# EAGLE schematic haasoscope_pro_adc_board - no blind (EAGLE 9.6.2)

## Sheet 1 of 3
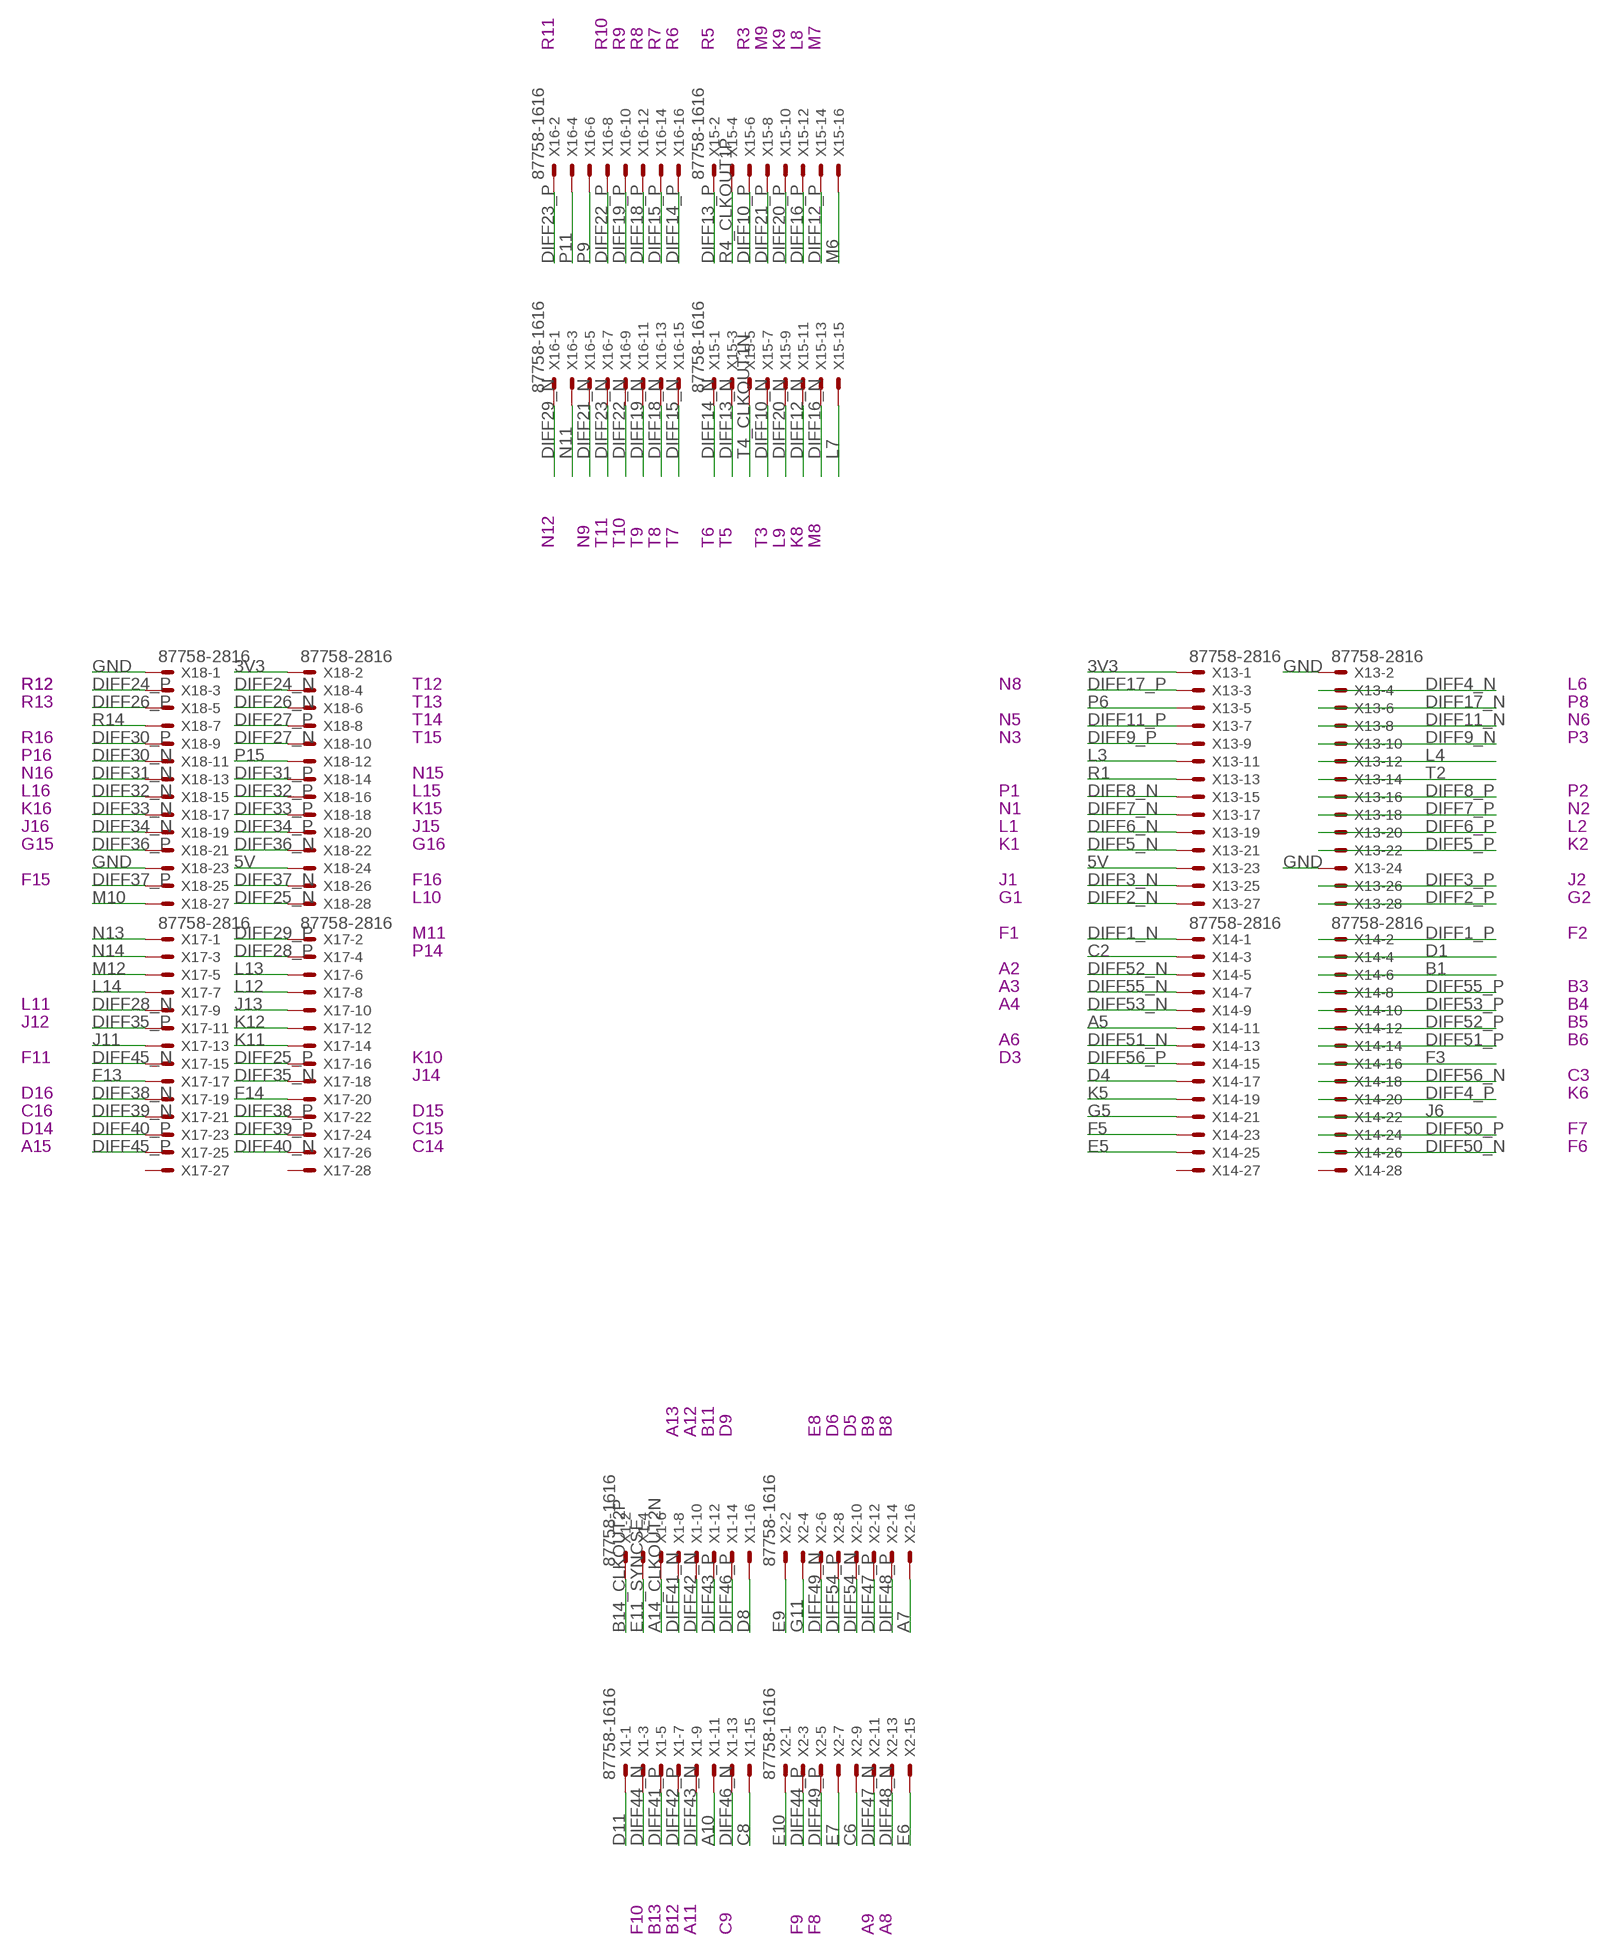
[diagram p0: schematic, sheet 1]

### Parts
X1  87758-1616  [87758-1616]
X2  87758-1616  [87758-1616]
X13  87758-2816  [87758-2816]
X14  87758-2816  [87758-2816]
X15  87758-1616  [87758-1616]
X16  87758-1616  [87758-1616]
X17  87758-2816  [87758-2816]
X18  87758-2816  [87758-2816]

### Nets
3V3 [power]: X13.1 X18.2 ; also sheet 2
5V [power]: X13.23 X18.24 ; also sheet 2
A5: X14.11 ; also sheet 2
A7: X2.16 ; also sheet 2
A10: X1.11 ; also sheet 2
A14_CLKOUT2N [loosediffpair]: X1.6 ; also sheet 2
B1: X14.6 ; also sheet 2
B14_CLKOUT2P [loosediffpair]: X1.2 ; also sheet 2
C2: X14.3 ; also sheet 2
C6: X2.9 ; also sheet 2
C8: X1.15 ; also sheet 2
D1: X14.4 ; also sheet 2
D4: X14.17 ; also sheet 2
D8: X1.16 ; also sheet 2
D11: X1.1 ; also sheet 2
DIFF1_N [diffpair]: X14.1 ; also sheet 2
DIFF1_P [diffpair]: X14.2 ; also sheet 2
DIFF2_N [diffpair]: X13.27 ; also sheet 2
DIFF2_P [diffpair]: X13.28 ; also sheet 2
DIFF3_N [diffpair]: X13.25 ; also sheet 2
DIFF3_P [diffpair]: X13.26 ; also sheet 2
DIFF4_N [diffpair]: X13.4 ; also sheet 2
DIFF4_P [diffpair]: X14.20 ; also sheet 2
DIFF5_N [diffpair]: X13.21 ; also sheet 2
DIFF5_P [diffpair]: X13.22 ; also sheet 2
DIFF6_N [diffpair]: X13.19 ; also sheet 2
DIFF6_P [diffpair]: X13.20 ; also sheet 2
DIFF7_N [diffpair]: X13.17 ; also sheet 2
DIFF7_P [diffpair]: X13.18 ; also sheet 2
DIFF8_N [diffpair]: X13.15 ; also sheet 2
DIFF8_P [diffpair]: X13.16 ; also sheet 2
DIFF9_N [diffpair]: X13.10 ; also sheet 2
DIFF9_P [diffpair]: X13.9 ; also sheet 2
DIFF10_N [diffpair]: X15.7 ; also sheet 2
DIFF10_P [diffpair]: X15.6 ; also sheet 2
DIFF11_N [diffpair]: X13.8 ; also sheet 2
DIFF11_P [diffpair]: X13.7 ; also sheet 2
DIFF12_N [diffpair]: X15.11 ; also sheet 2
DIFF12_P [diffpair]: X15.14 ; also sheet 2
DIFF13_N [diffpair]: X15.3 ; also sheet 2
DIFF13_P [diffpair]: X15.2 ; also sheet 2
DIFF14_N [diffpair]: X15.1 ; also sheet 2
DIFF14_P [diffpair]: X16.16 ; also sheet 2
DIFF15_N [diffpair]: X16.15 ; also sheet 2
DIFF15_P [diffpair]: X16.14 ; also sheet 2
DIFF16_N [diffpair]: X15.13 ; also sheet 2
DIFF16_P [diffpair]: X15.12 ; also sheet 2
DIFF17_N [diffpair]: X13.6 ; also sheet 2
DIFF17_P [diffpair]: X13.3 ; also sheet 2
DIFF18_N [diffpair]: X16.13 ; also sheet 2
DIFF18_P [diffpair]: X16.12 ; also sheet 2
DIFF19_N [diffpair]: X16.11 ; also sheet 2
DIFF19_P [diffpair]: X16.10 ; also sheet 2
DIFF20_N [diffpair]: X15.9 ; also sheet 2
DIFF20_P [diffpair]: X15.10 ; also sheet 2
DIFF21_N [diffpair]: X16.5 ; also sheet 2
DIFF21_P [diffpair]: X15.8 ; also sheet 2
DIFF22_N [diffpair]: X16.9 ; also sheet 2
DIFF22_P [diffpair]: X16.8 ; also sheet 2
DIFF23_N [diffpair]: X16.7 ; also sheet 2
DIFF23_P [diffpair]: X16.2 ; also sheet 2
DIFF24_N [diffpair]: X18.4 ; also sheet 2
DIFF24_P [diffpair]: X18.3 ; also sheet 2
DIFF25_N [diffpair]: X18.28 ; also sheet 2
DIFF25_P [diffpair]: X17.16 ; also sheet 2
DIFF26_N [diffpair]: X18.6 ; also sheet 2
DIFF26_P [diffpair]: X18.5 ; also sheet 2
DIFF27_N [diffpair]: X18.10 ; also sheet 2
DIFF27_P [diffpair]: X18.8 ; also sheet 2
DIFF28_N [diffpair]: X17.9 ; also sheet 2
DIFF28_P [diffpair]: X17.4 ; also sheet 2
DIFF29_N [diffpair]: X16.1 ; also sheet 2
DIFF29_P [diffpair]: X17.2 ; also sheet 2
DIFF30_N [diffpair]: X18.11 ; also sheet 2
DIFF30_P [diffpair]: X18.9 ; also sheet 2
DIFF31_N [diffpair]: X18.13 ; also sheet 2
DIFF31_P [diffpair]: X18.14 ; also sheet 2
DIFF32_N [diffpair]: X18.15 ; also sheet 2
DIFF32_P [diffpair]: X18.16 ; also sheet 2
DIFF33_N [diffpair]: X18.17 ; also sheet 2
DIFF33_P [diffpair]: X18.18 ; also sheet 2
DIFF34_N [diffpair]: X18.19 ; also sheet 2
DIFF34_P [diffpair]: X18.20 ; also sheet 2
DIFF35_N [diffpair]: X17.18 ; also sheet 2
DIFF35_P [diffpair]: X17.11 ; also sheet 2
DIFF36_N [diffpair]: X18.22 ; also sheet 2
DIFF36_P [diffpair]: X18.21 ; also sheet 2
DIFF37_N [diffpair]: X18.26 ; also sheet 2
DIFF37_P [diffpair]: X18.25 ; also sheet 2
DIFF38_N [diffpair]: X17.19 ; also sheet 2
DIFF38_P [diffpair]: X17.22 ; also sheet 2
DIFF39_N [diffpair]: X17.21 ; also sheet 2
DIFF39_P [diffpair]: X17.24 ; also sheet 2
DIFF40_N [diffpair]: X17.26 ; also sheet 2
DIFF40_P [diffpair]: X17.23 ; also sheet 2
DIFF41_N [diffpair]: X1.8 ; also sheet 2
DIFF41_P [diffpair]: X1.5 ; also sheet 2
DIFF42_N [diffpair]: X1.10 ; also sheet 2
DIFF42_P [diffpair]: X1.7 ; also sheet 2
DIFF43_N [diffpair]: X1.9 ; also sheet 2
DIFF43_P [diffpair]: X1.12 ; also sheet 2
DIFF44_N [diffpair]: X1.3 ; also sheet 2
DIFF44_P [diffpair]: X2.3 ; also sheet 2
DIFF45_N [diffpair]: X17.15 ; also sheet 2
DIFF45_P [diffpair]: X17.25 ; also sheet 2
DIFF46_N [diffpair]: X1.13 ; also sheet 2
DIFF46_P [diffpair]: X1.14 ; also sheet 2
DIFF47_N [diffpair]: X2.11 ; also sheet 2
DIFF47_P [diffpair]: X2.12 ; also sheet 2
DIFF48_N [diffpair]: X2.13 ; also sheet 2
DIFF48_P [diffpair]: X2.14 ; also sheet 2
DIFF49_N [diffpair]: X2.6 ; also sheet 2
DIFF49_P [diffpair]: X2.5 ; also sheet 2
DIFF50_N [diffpair]: X14.26 ; also sheet 2
DIFF50_P [diffpair]: X14.24 ; also sheet 2
DIFF51_N [diffpair]: X14.13 ; also sheet 2
DIFF51_P [diffpair]: X14.14 ; also sheet 2
DIFF52_N [diffpair]: X14.5 ; also sheet 2
DIFF52_P [diffpair]: X14.12 ; also sheet 2
DIFF53_N [diffpair]: X14.9 ; also sheet 2
DIFF53_P [diffpair]: X14.10 ; also sheet 2
DIFF54_N [diffpair]: X2.10 ; also sheet 2
DIFF54_P [diffpair]: X2.8 ; also sheet 2
DIFF55_N [diffpair]: X14.7 ; also sheet 2
DIFF55_P [diffpair]: X14.8 ; also sheet 2
DIFF56_N [diffpair]: X14.18 ; also sheet 2
DIFF56_P [diffpair]: X14.15 ; also sheet 2
E5: X14.25 ; also sheet 2
E6: X2.15 ; also sheet 2
E7: X2.7 ; also sheet 2
E9: X2.2 ; also sheet 2
E10: X2.1 ; also sheet 2
E11_SYNCSE: X1.4 ; also sheet 2
F3: X14.16 ; also sheet 2
F5: X14.23 ; also sheet 2
F13: X17.17 ; also sheet 2
F14: X17.20 ; also sheet 2
G5: X14.21 ; also sheet 2
G11: X2.4 ; also sheet 2
GND [power]: X13.2 X13.24 X18.1 X18.23 ; also sheet 2,3
J6: X14.22 ; also sheet 2
J11: X17.13 ; also sheet 2
J13: X17.10 ; also sheet 2
K5: X14.19 ; also sheet 2
K11: X17.14 ; also sheet 2
K12: X17.12 ; also sheet 2
L3: X13.11 ; also sheet 2
L4: X13.12 ; also sheet 2
L7: X15.15 ; also sheet 2
L12: X17.8 ; also sheet 2
L13: X17.6 ; also sheet 2
L14: X17.7 ; also sheet 2
M6: X15.16 ; also sheet 2
M10: X18.27 ; also sheet 2
M12: X17.5 ; also sheet 2
N11: X16.3 ; also sheet 2
N13: X17.1 ; also sheet 2
N14: X17.3 ; also sheet 2
P6: X13.5 ; also sheet 2
P9: X16.6 ; also sheet 2
P11: X16.4 ; also sheet 2
P15: X18.12 ; also sheet 2
R1: X13.13 ; also sheet 2
R4_CLKOUT1P [loosediffpair]: X15.4 ; also sheet 2
R14: X18.7 ; also sheet 2
T2: X13.14 ; also sheet 2
T4_CLKOUT1N [loosediffpair]: X15.5 ; also sheet 2
Unconnected: X14.27 X14.28 X17.27 X17.28

### Notes on the sheet
- R11 | R10 | R9 | R8 | R7 | R6 | R5 | R3 | M9 | K9 | L8 | M7
- N12 | N9 | T11 | T10 | T9 | T8 | T7 | T6 | T5 | T3 | L9 | K8 | M8
- R12 | R12 | T12 | N8 | L6
- R13 | T13 | P8
- T14 | N5 | N6
- R16 | T15 | N3 | P3
- P16
- N16 | N15
- L16 | L15 | P1 | P2
- K16 | K15 | N1 | N2
- J16 | J15 | L1 | L2
- G15 | G16 | K1 | K2
- F15 | F16 | J1 | J2
- L10 | G1 | G2
- M11 | F1 | F2
- P14
- A2
- A3 | B3
- L11 | A4 | B4
- J12 | B5
- A6 | B6
- F11 | K10 | D3
- J14 | C3
- D16 | K6
- C16 | D15
- D14 | C15 | F7
- A15 | C14 | F6
- A13 | A12 | B11 | D9 | E8 | D6 | D5 | B9 | B8
- F10 | B13 | B12 | A11 | C9 | F9 | F8 | A9 | A8

## Sheet 2 of 3
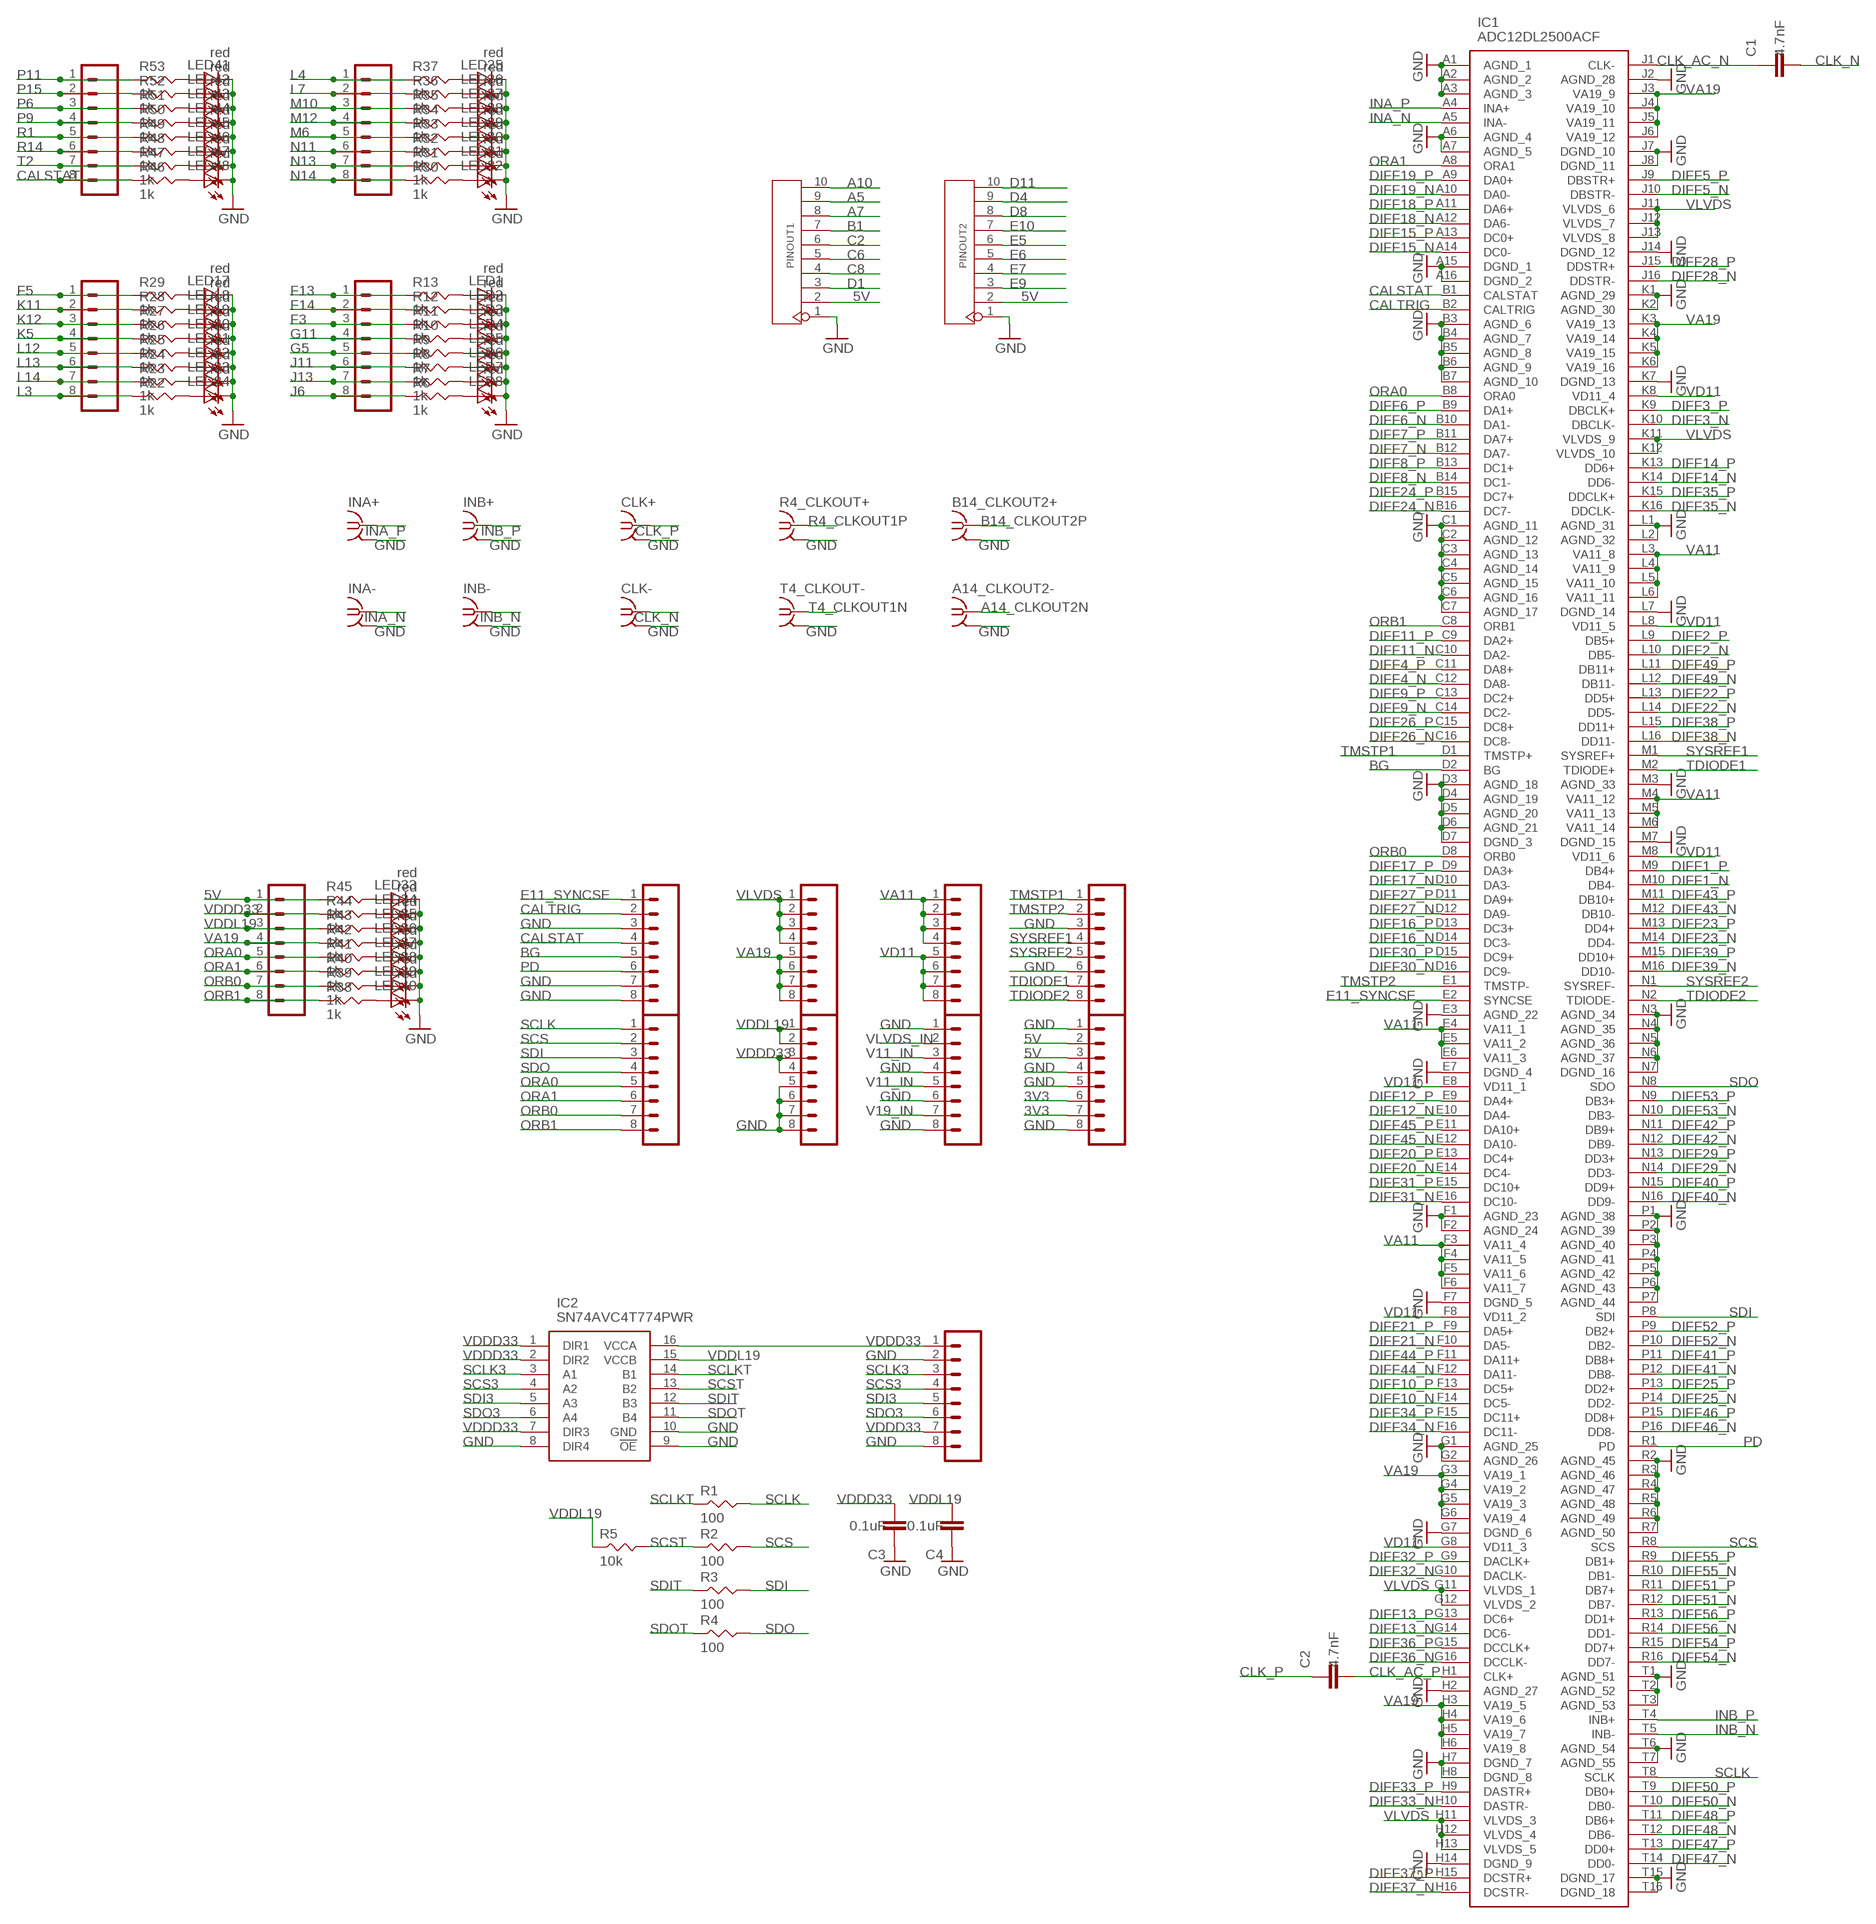
[diagram p1: schematic, sheet 2]

### Parts
A14_CLKOUT2-  BU-SMB-V  [BU-SMB-V]
B14_CLKOUT2+  BU-SMB-V  [BU-SMB-V]
C1  4.7nF  CAPACITOR_0402_N  [RESC0402_N]
C2  4.7nF  CAPACITOR_0402_N  [RESC0402_N]
C3  0.1uF  CAPACITOR_0402_N  [RESC0402_N]
C4  0.1uF  CAPACITOR_0402_N  [RESC0402_N]
CLK+  BU-SMB-V  [BU-SMB-V]
CLK-  BU-SMB-V  [BU-SMB-V]
IC1  ADC12DL2500ACF  [BGA256C100P16X16_1700X1700X331]
IC2  SN74AVC4T774PWR  [SOP65P640X120-16N]
INA+  BU-SMB-V  [BU-SMB-V]
INA-  BU-SMB-V  [BU-SMB-V]
INB+  BU-SMB-V  [BU-SMB-V]
INB-  BU-SMB-V  [BU-SMB-V]
J1  8pin  CONN_08"  [1X08]
J2  8pin  CONN_08"  [1X08]
J3  8pin  CONN_08"  [1X08]
J4  8pin  CONN_08"  [1X08]
J5  8pin  CONN_08"  [1X08]
J6  8pin  CONN_08"  [1X08]
J7  8pin  CONN_08"  [1X08]
J8  8pin  CONN_08"  [1X08]
J10  8pin  CONN_08"  [1X08]
J11  8pin  CONN_08"  [1X08]
J12  8pin  CONN_08"  [1X08]
J13  8pin  CONN_08"  [1X08]
J16  8pin  CONN_08"  [1X08]
J17  8pin  CONN_08"  [1X08]
LED1  red  LEDCHIP-LED0603  [CHIP-LED0603]
LED2  red  LEDCHIP-LED0603  [CHIP-LED0603]
LED3  red  LEDCHIP-LED0603  [CHIP-LED0603]
LED4  red  LEDCHIP-LED0603  [CHIP-LED0603]
LED5  red  LEDCHIP-LED0603  [CHIP-LED0603]
LED6  red  LEDCHIP-LED0603  [CHIP-LED0603]
LED7  red  LEDCHIP-LED0603  [CHIP-LED0603]
LED8  red  LEDCHIP-LED0603  [CHIP-LED0603]
LED17  red  LEDCHIP-LED0603  [CHIP-LED0603]
LED18  red  LEDCHIP-LED0603  [CHIP-LED0603]
LED19  red  LEDCHIP-LED0603  [CHIP-LED0603]
LED20  red  LEDCHIP-LED0603  [CHIP-LED0603]
LED21  red  LEDCHIP-LED0603  [CHIP-LED0603]
LED22  red  LEDCHIP-LED0603  [CHIP-LED0603]
LED23  red  LEDCHIP-LED0603  [CHIP-LED0603]
LED24  red  LEDCHIP-LED0603  [CHIP-LED0603]
LED25  red  LEDCHIP-LED0603  [CHIP-LED0603]
LED26  red  LEDCHIP-LED0603  [CHIP-LED0603]
LED27  red  LEDCHIP-LED0603  [CHIP-LED0603]
LED28  red  LEDCHIP-LED0603  [CHIP-LED0603]
LED29  red  LEDCHIP-LED0603  [CHIP-LED0603]
LED30  red  LEDCHIP-LED0603  [CHIP-LED0603]
LED31  red  LEDCHIP-LED0603  [CHIP-LED0603]
LED32  red  LEDCHIP-LED0603  [CHIP-LED0603]
LED33  red  LEDCHIP-LED0603  [CHIP-LED0603]
LED34  red  LEDCHIP-LED0603  [CHIP-LED0603]
LED35  red  LEDCHIP-LED0603  [CHIP-LED0603]
LED36  red  LEDCHIP-LED0603  [CHIP-LED0603]
LED37  red  LEDCHIP-LED0603  [CHIP-LED0603]
LED38  red  LEDCHIP-LED0603  [CHIP-LED0603]
LED39  red  LEDCHIP-LED0603  [CHIP-LED0603]
LED40  red  LEDCHIP-LED0603  [CHIP-LED0603]
LED41  red  LEDCHIP-LED0603  [CHIP-LED0603]
LED42  red  LEDCHIP-LED0603  [CHIP-LED0603]
LED43  red  LEDCHIP-LED0603  [CHIP-LED0603]
LED44  red  LEDCHIP-LED0603  [CHIP-LED0603]
LED45  red  LEDCHIP-LED0603  [CHIP-LED0603]
LED46  red  LEDCHIP-LED0603  [CHIP-LED0603]
LED47  red  LEDCHIP-LED0603  [CHIP-LED0603]
LED48  red  LEDCHIP-LED0603  [CHIP-LED0603]
PINOUT1  YELLOW-10P-2.54  DIP-YELLOW-FEMALE-HEADER-VERT(10P-2.54)  [H10-2.54]
PINOUT2  YELLOW-10P-2.54  DIP-YELLOW-FEMALE-HEADER-VERT(10P-2.54)  [H10-2.54]
R1  100  RES-0402  [RES-0402]
R2  100  RES-0402  [RES-0402]
R3  100  RES-0402  [RES-0402]
R4  100  RES-0402  [RES-0402]
R4_CLKOUT+  BU-SMB-V  [BU-SMB-V]
R5  10k  RES-0402  [RES-0402]
R6  1k  RES-0402  [RES-0402]
R7  1k  RES-0402  [RES-0402]
R8  1k  RES-0402  [RES-0402]
R9  1k  RES-0402  [RES-0402]
R10  1k  RES-0402  [RES-0402]
R11  1k  RES-0402  [RES-0402]
R12  1k  RES-0402  [RES-0402]
R13  1k  RES-0402  [RES-0402]
R22  1k  RES-0402  [RES-0402]
R23  1k  RES-0402  [RES-0402]
R24  1k  RES-0402  [RES-0402]
R25  1k  RES-0402  [RES-0402]
R26  1k  RES-0402  [RES-0402]
R27  1k  RES-0402  [RES-0402]
R28  1k  RES-0402  [RES-0402]
R29  1k  RES-0402  [RES-0402]
R30  1k  RES-0402  [RES-0402]
R31  1k  RES-0402  [RES-0402]
R32  1k  RES-0402  [RES-0402]
R33  1k  RES-0402  [RES-0402]
R34  1k  RES-0402  [RES-0402]
R35  1k  RES-0402  [RES-0402]
R36  1k  RES-0402  [RES-0402]
R37  1k  RES-0402  [RES-0402]
R38  1k  RES-0402  [RES-0402]
R39  1k  RES-0402  [RES-0402]
R40  1k  RES-0402  [RES-0402]
R41  1k  RES-0402  [RES-0402]
R42  1k  RES-0402  [RES-0402]
R43  1k  RES-0402  [RES-0402]
R44  1k  RES-0402  [RES-0402]
R45  1k  RES-0402  [RES-0402]
R46  1k  RES-0402  [RES-0402]
R47  1k  RES-0402  [RES-0402]
R48  1k  RES-0402  [RES-0402]
R49  1k  RES-0402  [RES-0402]
R50  1k  RES-0402  [RES-0402]
R51  1k  RES-0402  [RES-0402]
R52  1k  RES-0402  [RES-0402]
R53  1k  RES-0402  [RES-0402]
T4_CLKOUT-  BU-SMB-V  [BU-SMB-V]

### Nets
3V3 [power]: J6.6 J6.7 ; also sheet 1
5V [power]: J6.2 J6.3 J12.1 PINOUT1.2 PINOUT2.2 R45.P$1 ; also sheet 1
A5: PINOUT1.9 ; also sheet 1
A7: PINOUT1.8 ; also sheet 1
A10: PINOUT1.10 ; also sheet 1
A14_CLKOUT2N [loosediffpair]: A14_CLKOUT2-.1 ; also sheet 1
B1: PINOUT1.7 ; also sheet 1
B14_CLKOUT2P [loosediffpair]: B14_CLKOUT2+.1 ; also sheet 1
BG: IC1.D2(BG) J17.5
C2: PINOUT1.6 ; also sheet 1
C6: PINOUT1.5 ; also sheet 1
C8: PINOUT1.4 ; also sheet 1
CALSTAT: IC1.B1(CALSTAT) J13.8 J17.4 R46.P$1
CALTRIG: IC1.B2(CALTRIG) J17.2
CLK_AC_N [loosediffpair]: C1.1 IC1.J1(CLK-)
CLK_AC_P [loosediffpair]: C2.2 IC1.H1(CLK+)
CLK_N [loosediffpair]: C1.2 CLK-.1
CLK_P [loosediffpair]: C2.1 CLK+.1
D1: PINOUT1.3 ; also sheet 1
D4: PINOUT2.9 ; also sheet 1
D8: PINOUT2.8 ; also sheet 1
D11: PINOUT2.10 ; also sheet 1
DIFF1_N [diffpair]: IC1.M10(DB4-) ; also sheet 1
DIFF1_P [diffpair]: IC1.M9(DB4+) ; also sheet 1
DIFF2_N [diffpair]: IC1.L10(DB5-) ; also sheet 1
DIFF2_P [diffpair]: IC1.L9(DB5+) ; also sheet 1
DIFF3_N [diffpair]: IC1.K10(DBCLK-) ; also sheet 1
DIFF3_P [diffpair]: IC1.K9(DBCLK+) ; also sheet 1
DIFF4_N [diffpair]: IC1.C12(DA8-) ; also sheet 1
DIFF4_P [diffpair]: IC1.C11(DA8+) ; also sheet 1
DIFF5_N [diffpair]: IC1.J10(DBSTR-) ; also sheet 1
DIFF5_P [diffpair]: IC1.J9(DBSTR+) ; also sheet 1
DIFF6_N [diffpair]: IC1.B10(DA1-) ; also sheet 1
DIFF6_P [diffpair]: IC1.B9(DA1+) ; also sheet 1
DIFF7_N [diffpair]: IC1.B12(DA7-) ; also sheet 1
DIFF7_P [diffpair]: IC1.B11(DA7+) ; also sheet 1
DIFF8_N [diffpair]: IC1.B14(DC1-) ; also sheet 1
DIFF8_P [diffpair]: IC1.B13(DC1+) ; also sheet 1
DIFF9_N [diffpair]: IC1.C14(DC2-) ; also sheet 1
DIFF9_P [diffpair]: IC1.C13(DC2+) ; also sheet 1
DIFF10_N [diffpair]: IC1.F14(DC5-) ; also sheet 1
DIFF10_P [diffpair]: IC1.F13(DC5+) ; also sheet 1
DIFF11_N [diffpair]: IC1.C10(DA2-) ; also sheet 1
DIFF11_P [diffpair]: IC1.C9(DA2+) ; also sheet 1
DIFF12_N [diffpair]: IC1.E10(DA4-) ; also sheet 1
DIFF12_P [diffpair]: IC1.E9(DA4+) ; also sheet 1
DIFF13_N [diffpair]: IC1.G14(DC6-) ; also sheet 1
DIFF13_P [diffpair]: IC1.G13(DC6+) ; also sheet 1
DIFF14_N [diffpair]: IC1.K14(DD6-) ; also sheet 1
DIFF14_P [diffpair]: IC1.K13(DD6+) ; also sheet 1
DIFF15_N [diffpair]: IC1.A14(DC0-) ; also sheet 1
DIFF15_P [diffpair]: IC1.A13(DC0+) ; also sheet 1
DIFF16_N [diffpair]: IC1.D14(DC3-) ; also sheet 1
DIFF16_P [diffpair]: IC1.D13(DC3+) ; also sheet 1
DIFF17_N [diffpair]: IC1.D10(DA3-) ; also sheet 1
DIFF17_P [diffpair]: IC1.D9(DA3+) ; also sheet 1
DIFF18_N [diffpair]: IC1.A12(DA6-) ; also sheet 1
DIFF18_P [diffpair]: IC1.A11(DA6+) ; also sheet 1
DIFF19_N [diffpair]: IC1.A10(DA0-) ; also sheet 1
DIFF19_P [diffpair]: IC1.A9(DA0+) ; also sheet 1
DIFF20_N [diffpair]: IC1.E14(DC4-) ; also sheet 1
DIFF20_P [diffpair]: IC1.E13(DC4+) ; also sheet 1
DIFF21_N [diffpair]: IC1.F10(DA5-) ; also sheet 1
DIFF21_P [diffpair]: IC1.F9(DA5+) ; also sheet 1
DIFF22_N [diffpair]: IC1.L14(DD5-) ; also sheet 1
DIFF22_P [diffpair]: IC1.L13(DD5+) ; also sheet 1
DIFF23_N [diffpair]: IC1.M14(DD4-) ; also sheet 1
DIFF23_P [diffpair]: IC1.M13(DD4+) ; also sheet 1
DIFF24_N [diffpair]: IC1.B16(DC7-) ; also sheet 1
DIFF24_P [diffpair]: IC1.B15(DC7+) ; also sheet 1
DIFF25_N [diffpair]: IC1.P14(DD2-) ; also sheet 1
DIFF25_P [diffpair]: IC1.P13(DD2+) ; also sheet 1
DIFF26_N [diffpair]: IC1.C16(DC8-) ; also sheet 1
DIFF26_P [diffpair]: IC1.C15(DC8+) ; also sheet 1
DIFF27_N [diffpair]: IC1.D12(DA9-) ; also sheet 1
DIFF27_P [diffpair]: IC1.D11(DA9+) ; also sheet 1
DIFF28_N [diffpair]: IC1.J16(DDSTR-) ; also sheet 1
DIFF28_P [diffpair]: IC1.J15(DDSTR+) ; also sheet 1
DIFF29_N [diffpair]: IC1.N14(DD3-) ; also sheet 1
DIFF29_P [diffpair]: IC1.N13(DD3+) ; also sheet 1
DIFF30_N [diffpair]: IC1.D16(DC9-) ; also sheet 1
DIFF30_P [diffpair]: IC1.D15(DC9+) ; also sheet 1
DIFF31_N [diffpair]: IC1.E16(DC10-) ; also sheet 1
DIFF31_P [diffpair]: IC1.E15(DC10+) ; also sheet 1
DIFF32_N [diffpair]: IC1.G10(DACLK-) ; also sheet 1
DIFF32_P [diffpair]: IC1.G9(DACLK+) ; also sheet 1
DIFF33_N [diffpair]: IC1.H10(DASTR-) ; also sheet 1
DIFF33_P [diffpair]: IC1.H9(DASTR+) ; also sheet 1
DIFF34_N [diffpair]: IC1.F16(DC11-) ; also sheet 1
DIFF34_P [diffpair]: IC1.F15(DC11+) ; also sheet 1
DIFF35_N [diffpair]: IC1.K16(DDCLK-) ; also sheet 1
DIFF35_P [diffpair]: IC1.K15(DDCLK+) ; also sheet 1
DIFF36_N [diffpair]: IC1.G16(DCCLK-) ; also sheet 1
DIFF36_P [diffpair]: IC1.G15(DCCLK+) ; also sheet 1
DIFF37_N [diffpair]: IC1.H16(DCSTR-) ; also sheet 1
DIFF37_P [diffpair]: IC1.H15(DCSTR+) ; also sheet 1
DIFF38_N [diffpair]: IC1.L16(DD11-) ; also sheet 1
DIFF38_P [diffpair]: IC1.L15(DD11+) ; also sheet 1
DIFF39_N [diffpair]: IC1.M16(DD10-) ; also sheet 1
DIFF39_P [diffpair]: IC1.M15(DD10+) ; also sheet 1
DIFF40_N [diffpair]: IC1.N16(DD9-) ; also sheet 1
DIFF40_P [diffpair]: IC1.N15(DD9+) ; also sheet 1
DIFF41_N [diffpair]: IC1.P12(DB8-) ; also sheet 1
DIFF41_P [diffpair]: IC1.P11(DB8+) ; also sheet 1
DIFF42_N [diffpair]: IC1.N12(DB9-) ; also sheet 1
DIFF42_P [diffpair]: IC1.N11(DB9+) ; also sheet 1
DIFF43_N [diffpair]: IC1.M12(DB10-) ; also sheet 1
DIFF43_P [diffpair]: IC1.M11(DB10+) ; also sheet 1
DIFF44_N [diffpair]: IC1.F12(DA11-) ; also sheet 1
DIFF44_P [diffpair]: IC1.F11(DA11+) ; also sheet 1
DIFF45_N [diffpair]: IC1.E12(DA10-) ; also sheet 1
DIFF45_P [diffpair]: IC1.E11(DA10+) ; also sheet 1
DIFF46_N [diffpair]: IC1.P16(DD8-) ; also sheet 1
DIFF46_P [diffpair]: IC1.P15(DD8+) ; also sheet 1
DIFF47_N [diffpair]: IC1.T14(DD0-) ; also sheet 1
DIFF47_P [diffpair]: IC1.T13(DD0+) ; also sheet 1
DIFF48_N [diffpair]: IC1.T12(DB6-) ; also sheet 1
DIFF48_P [diffpair]: IC1.T11(DB6+) ; also sheet 1
DIFF49_N [diffpair]: IC1.L12(DB11-) ; also sheet 1
DIFF49_P [diffpair]: IC1.L11(DB11+) ; also sheet 1
DIFF50_N [diffpair]: IC1.T10(DB0-) ; also sheet 1
DIFF50_P [diffpair]: IC1.T9(DB0+) ; also sheet 1
DIFF51_N [diffpair]: IC1.R12(DB7-) ; also sheet 1
DIFF51_P [diffpair]: IC1.R11(DB7+) ; also sheet 1
DIFF52_N [diffpair]: IC1.P10(DB2-) ; also sheet 1
DIFF52_P [diffpair]: IC1.P9(DB2+) ; also sheet 1
DIFF53_N [diffpair]: IC1.N10(DB3-) ; also sheet 1
DIFF53_P [diffpair]: IC1.N9(DB3+) ; also sheet 1
DIFF54_N [diffpair]: IC1.R16(DD7-) ; also sheet 1
DIFF54_P [diffpair]: IC1.R15(DD7+) ; also sheet 1
DIFF55_N [diffpair]: IC1.R10(DB1-) ; also sheet 1
DIFF55_P [diffpair]: IC1.R9(DB1+) ; also sheet 1
DIFF56_N [diffpair]: IC1.R14(DD1-) ; also sheet 1
DIFF56_P [diffpair]: IC1.R13(DD1+) ; also sheet 1
E5: PINOUT2.6 ; also sheet 1
E6: PINOUT2.5 ; also sheet 1
E7: PINOUT2.4 ; also sheet 1
E9: PINOUT2.3 ; also sheet 1
E10: PINOUT2.7 ; also sheet 1
E11_SYNCSE: IC1.E2(SYNCSE) J17.1 ; also sheet 1
F3: J8.3 R11.P$1 ; also sheet 1
F5: J10.1 R29.P$1 ; also sheet 1
F13: J8.1 R13.P$1 ; also sheet 1
F14: J8.2 R12.P$1 ; also sheet 1
G5: J8.5 R9.P$1 ; also sheet 1
G11: J8.4 R10.P$1 ; also sheet 1
GND [power]: A14_CLKOUT2-.2 A14_CLKOUT2-.3 A14_CLKOUT2-.4 A14_CLKOUT2-.5 B14_CLKOUT2+.2 B14_CLKOUT2+.3 B14_CLKOUT2+.4 B14_CLKOUT2+.5 C3.1 C4.1 CLK+.2 CLK+.3 CLK+.4 CLK+.5 CLK-.2 CLK-.3 CLK-.4 CLK-.5 IC1.A1(AGND_1) IC1.A2(AGND_2) IC1.A3(AGND_3) IC1.A6(AGND_4) IC1.A7(AGND_5) IC1.A15(DGND_1) IC1.A16(DGND_2) IC1.B3(AGND_6) IC1.B4(AGND_7) IC1.B5(AGND_8) IC1.B6(AGND_9) IC1.B7(AGND_10) IC1.C1(AGND_11) IC1.C2(AGND_12) IC1.C3(AGND_13) IC1.C4(AGND_14) IC1.C5(AGND_15) IC1.C6(AGND_16) IC1.C7(AGND_17) IC1.D3(AGND_18) IC1.D4(AGND_19) IC1.D5(AGND_20) IC1.D6(AGND_21) IC1.D7(DGND_3) IC1.E3(AGND_22) IC1.E7(DGND_4) IC1.F1(AGND_23) IC1.F2(AGND_24) IC1.F7(DGND_5) IC1.G1(AGND_25) IC1.G2(AGND_26) IC1.G7(DGND_6) IC1.H2(AGND_27) IC1.H7(DGND_7) IC1.H8(DGND_8) IC1.H14(DGND_9) IC1.J2(AGND_28) IC1.J7(DGND_10) IC1.J8(DGND_11) IC1.J14(DGND_12) IC1.K1(AGND_29) IC1.K2(AGND_30) IC1.K7(DGND_13) IC1.L1(AGND_31) IC1.L2(AGND_32) IC1.L7(DGND_14) IC1.M3(AGND_33) IC1.M7(DGND_15) IC1.N3(AGND_34) IC1.N4(AGND_35) IC1.N5(AGND_36) IC1.N6(AGND_37) IC1.N7(DGND_16) IC1.P1(AGND_38) IC1.P2(AGND_39) IC1.P3(AGND_40) IC1.P4(AGND_41) IC1.P5(AGND_42) IC1.P6(AGND_43) IC1.P7(AGND_44) IC1.R2(AGND_45) IC1.R3(AGND_46) IC1.R4(AGND_47) IC1.R5(AGND_48) IC1.R6(AGND_49) IC1.R7(AGND_50) IC1.T1(AGND_51) IC1.T2(AGND_52) IC1.T3(AGND_53) IC1.T6(AGND_54) IC1.T7(AGND_55) IC1.T15(DGND_17) IC1.T16(DGND_18) IC2.8(DIR4) IC2.9(!OE) IC2.10(GND) INA+.2 INA+.3 INA+.4 INA+.5 INA-.2 INA-.3 INA-.4 INA-.5 INB+.2 INB+.3 INB+.4 INB+.5 INB-.2 INB-.3 INB-.4 INB-.5 J2.5 J2.6 J2.7 J2.8 J4.2 J4.8 J5.1 J5.4 J5.6 J5.8 J6.1 J6.4 J6.5 J6.8 J7.3 J7.6 J17.3 J17.7 J17.8 LED1.C LED2.C LED3.C LED4.C LED5.C LED6.C LED7.C LED8.C LED17.C LED18.C LED19.C LED20.C LED21.C LED22.C LED23.C LED24.C LED25.C LED26.C LED27.C LED28.C LED29.C LED30.C LED31.C LED32.C LED33.C LED34.C LED35.C LED36.C LED37.C LED38.C LED39.C LED40.C LED41.C LED42.C LED43.C LED44.C LED45.C LED46.C LED47.C LED48.C PINOUT1.1 PINOUT2.1 R4_CLKOUT+.2 R4_CLKOUT+.3 R4_CLKOUT+.4 R4_CLKOUT+.5 T4_CLKOUT-.2 T4_CLKOUT-.3 T4_CLKOUT-.4 T4_CLKOUT-.5 ; also sheet 1,3
INA_N [loosediffpair]: IC1.A5(INA-) INA-.1
INA_P [loosediffpair]: IC1.A4(INA+) INA+.1
INB_N [loosediffpair]: IC1.T5(INB-) INB-.1
INB_P [loosediffpair]: IC1.T4(INB+) INB+.1
J6: J8.8 R6.P$1 ; also sheet 1
J11: J8.6 R8.P$1 ; also sheet 1
J13: J8.7 R7.P$1 ; also sheet 1
K5: J10.4 R26.P$1 ; also sheet 1
K11: J10.2 R28.P$1 ; also sheet 1
K12: J10.3 R27.P$1 ; also sheet 1
L3: J10.8 R22.P$1 ; also sheet 1
L4: J11.1 R37.P$1 ; also sheet 1
L7: J11.2 R36.P$1 ; also sheet 1
L12: J10.5 R25.P$1 ; also sheet 1
L13: J10.6 R24.P$1 ; also sheet 1
L14: J10.7 R23.P$1 ; also sheet 1
M6: J11.5 R33.P$1 ; also sheet 1
M10: J11.3 R35.P$1 ; also sheet 1
M12: J11.4 R34.P$1 ; also sheet 1
N11: J11.6 R32.P$1 ; also sheet 1
N13: J11.7 R31.P$1 ; also sheet 1
N14: J11.8 R30.P$1 ; also sheet 1
N$1: LED1.A R13.P$2
N$2: LED2.A R12.P$2
N$3: LED3.A R11.P$2
N$4: LED4.A R10.P$2
N$5: LED5.A R9.P$2
N$6: LED6.A R8.P$2
N$7: LED7.A R7.P$2
N$8: LED8.A R6.P$2
N$17: LED17.A R29.P$2
N$18: LED18.A R28.P$2
N$19: LED19.A R27.P$2
N$20: LED20.A R26.P$2
N$21: LED21.A R25.P$2
N$22: LED22.A R24.P$2
N$23: LED23.A R23.P$2
N$24: LED24.A R22.P$2
N$25: LED25.A R37.P$2
N$26: LED26.A R36.P$2
N$27: LED27.A R35.P$2
N$28: LED28.A R34.P$2
N$29: LED29.A R33.P$2
N$30: LED30.A R32.P$2
N$31: LED31.A R31.P$2
N$32: LED32.A R30.P$2
N$33: LED33.A R45.P$2
N$34: LED34.A R44.P$2
N$35: LED35.A R43.P$2
N$36: LED36.A R42.P$2
N$37: LED37.A R41.P$2
N$38: LED38.A R40.P$2
N$39: LED39.A R39.P$2
N$40: LED40.A R38.P$2
N$41: LED41.A R53.P$2
N$42: LED42.A R52.P$2
N$43: LED43.A R51.P$2
N$44: LED44.A R50.P$2
N$45: LED45.A R49.P$2
N$46: LED46.A R48.P$2
N$47: LED47.A R47.P$2
N$48: LED48.A R46.P$2
ORA0: IC1.B8(ORA0) J12.5 J16.5 R41.P$1
ORA1: IC1.A8(ORA1) J12.6 J16.6 R40.P$1
ORB0: IC1.D8(ORB0) J12.7 J16.7 R39.P$1
ORB1: IC1.C8(ORB1) J12.8 J16.8 R38.P$1
P6: J13.3 R51.P$1 ; also sheet 1
P9: J13.4 R50.P$1 ; also sheet 1
P11: J13.1 R53.P$1 ; also sheet 1
P15: J13.2 R52.P$1 ; also sheet 1
PD: IC1.R1(PD) J17.6
R1: J13.5 R49.P$1 ; also sheet 1
R4_CLKOUT1P [loosediffpair]: R4_CLKOUT+.1 ; also sheet 1
R14: J13.6 R48.P$1 ; also sheet 1
SCLK: IC1.T8(SCLK) J16.1 R1.P$2
SCLK3: IC2.3(A1) J4.3
SCLKT: IC2.14(B1) R1.P$1
SCS: IC1.R8(SCS) J16.2 R2.P$2
SCS3: IC2.4(A2) J4.4
SCST: IC2.13(B2) R2.P$1 R5.P$2
SDI: IC1.P8(SDI) J16.3 R3.P$2
SDI3: IC2.5(A3) J4.5
SDIT: IC2.12(B3) R3.P$1
SDO: IC1.N8(SDO) J16.4 R4.P$2
SDO3: IC2.6(A4) J4.6
SDOT: IC2.11(B4) R4.P$1
SYSREF1 [diffpair]: IC1.M1(SYSREF+) J7.4
SYSREF2 [diffpair]: IC1.N1(SYSREF-) J7.5
T2: J13.7 R47.P$1 ; also sheet 1
T4_CLKOUT1N [loosediffpair]: T4_CLKOUT-.1 ; also sheet 1
TDIODE1 [diffpair]: IC1.M2(TDIODE+) J7.7
TDIODE2 [diffpair]: IC1.N2(TDIODE-) J7.8
TMSTP1 [diffpair]: IC1.D1(TMSTP+) J7.1
TMSTP2 [diffpair]: IC1.E1(TMSTP-) J7.2
V11_IN [power]: J5.3 J5.5 ; also sheet 3
V19_IN [power]: J5.7 ; also sheet 3
VA11 [power]: IC1.E4(VA11_1) IC1.E5(VA11_2) IC1.E6(VA11_3) IC1.F3(VA11_4) IC1.F4(VA11_5) IC1.F5(VA11_6) IC1.F6(VA11_7) IC1.L3(VA11_8) IC1.L4(VA11_9) IC1.L5(VA11_10) IC1.L6(VA11_11) IC1.M4(VA11_12) IC1.M5(VA11_13) IC1.M6(VA11_14) J3.1 J3.2 J3.3 J3.4 ; also sheet 3
VA19 [power]: IC1.G3(VA19_1) IC1.G4(VA19_2) IC1.G5(VA19_3) IC1.G6(VA19_4) IC1.H3(VA19_5) IC1.H4(VA19_6) IC1.H5(VA19_7) IC1.H6(VA19_8) IC1.J3(VA19_9) IC1.J4(VA19_10) IC1.J5(VA19_11) IC1.J6(VA19_12) IC1.K3(VA19_13) IC1.K4(VA19_14) IC1.K5(VA19_15) IC1.K6(VA19_16) J1.5 J1.6 J1.7 J1.8 J12.4 R42.P$1 ; also sheet 3
VD11 [power]: IC1.E8(VD11_1) IC1.F8(VD11_2) IC1.G8(VD11_3) IC1.K8(VD11_4) IC1.L8(VD11_5) IC1.M8(VD11_6) J3.5 J3.6 J3.7 J3.8 ; also sheet 3
VDDD33 [power]: C3.2 IC2.1(DIR1) IC2.2(DIR2) IC2.7(DIR3) IC2.16(VCCA) J2.3 J2.4 J4.1 J4.7 J12.2 R44.P$1
VDDL19 [power]: C4.2 IC2.15(VCCB) J2.1 J2.2 J12.3 R5.P$1 R43.P$1 ; also sheet 3
VLVDS [power]: IC1.G11(VLVDS_1) IC1.G12(VLVDS_2) IC1.H11(VLVDS_3) IC1.H12(VLVDS_4) IC1.H13(VLVDS_5) IC1.J11(VLVDS_6) IC1.J12(VLVDS_7) IC1.J13(VLVDS_8) IC1.K11(VLVDS_9) IC1.K12(VLVDS_10) J1.1 J1.2 J1.3 J1.4 ; also sheet 3
VLVDS_IN [power]: J5.2 ; also sheet 3

## Sheet 3 of 3
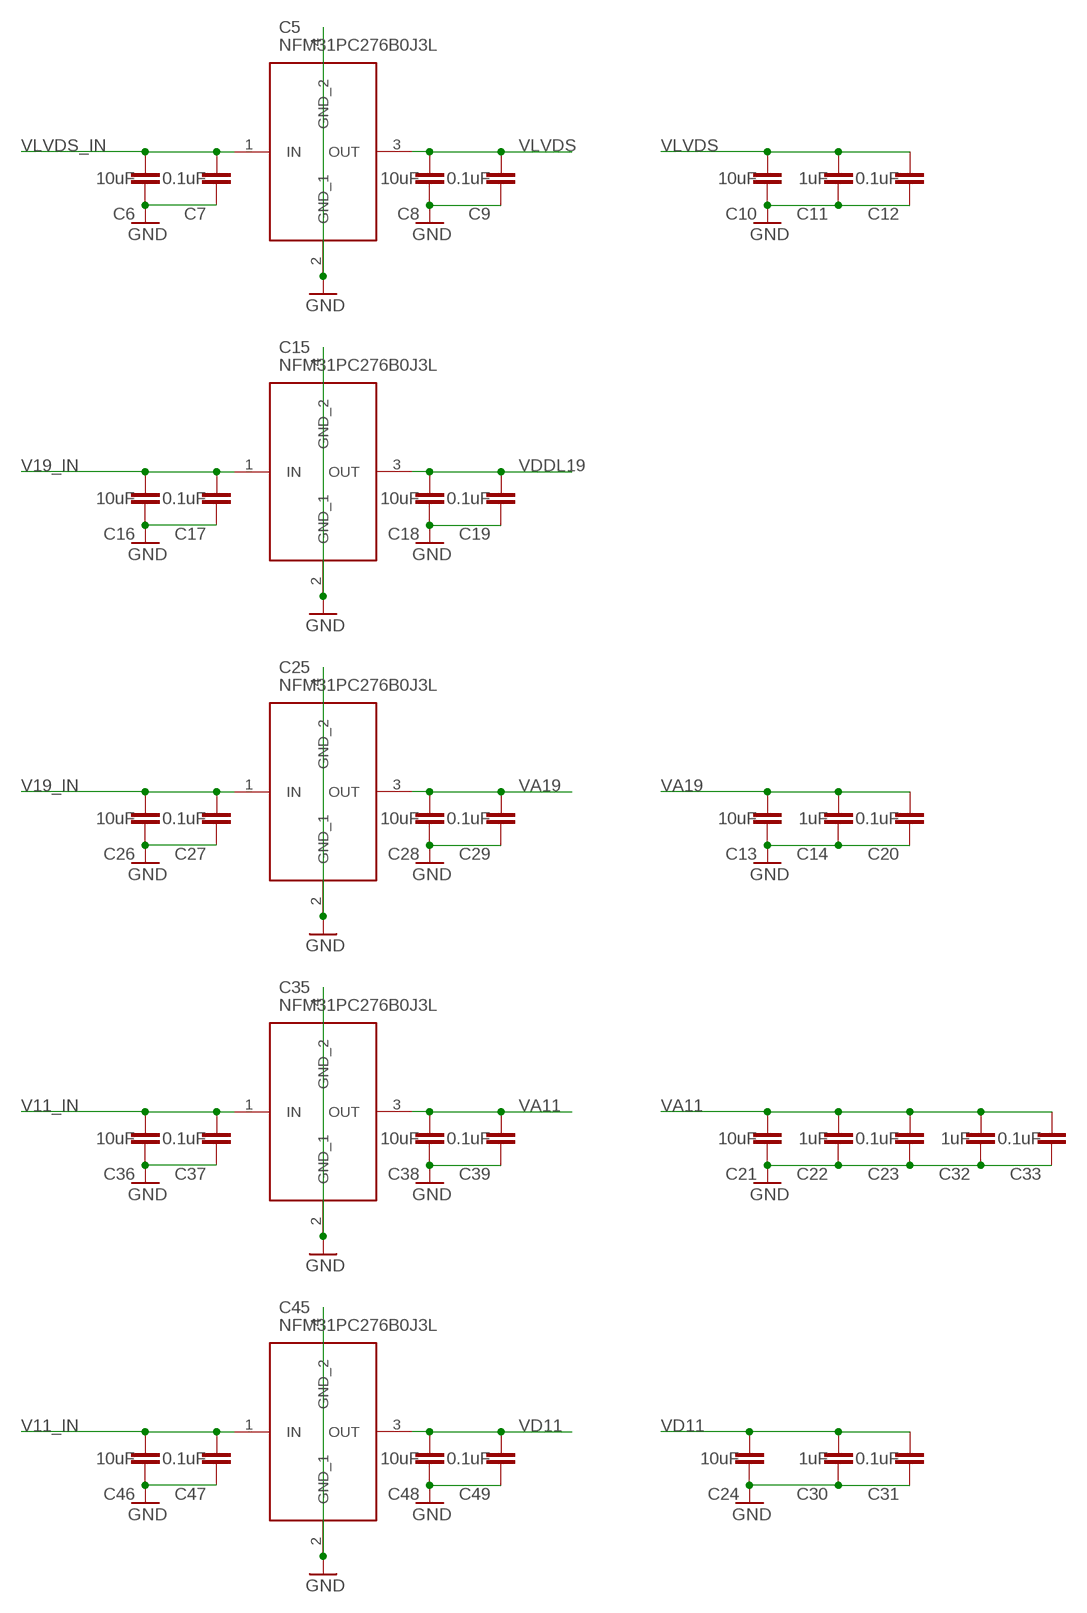
[diagram p2: schematic, sheet 3]

### Parts
C5  NFM31PC276B0J3L  [NFM31HK103R1H3L]
C6  10uF  CAPACITOR_0805_N  [RESC0805_N]
C7  0.1uF  CAPACITOR_0402_N  [RESC0402_N]
C8  10uF  CAPACITOR_0805_N  [RESC0805_N]
C9  0.1uF  CAPACITOR_0402_N  [RESC0402_N]
C10  10uF  CAPACITOR_0805_N  [RESC0805_N]
C11  1uF  CAPACITOR_0402_N  [RESC0402_N]
C12  0.1uF  CAPACITOR_0402_N  [RESC0402_N]
C13  10uF  CAPACITOR_0805_N  [RESC0805_N]
C14  1uF  CAPACITOR_0402_N  [RESC0402_N]
C15  NFM31PC276B0J3L  [NFM31HK103R1H3L]
C16  10uF  CAPACITOR_0805_N  [RESC0805_N]
C17  0.1uF  CAPACITOR_0402_N  [RESC0402_N]
C18  10uF  CAPACITOR_0805_N  [RESC0805_N]
C19  0.1uF  CAPACITOR_0402_N  [RESC0402_N]
C20  0.1uF  CAPACITOR_0402_N  [RESC0402_N]
C21  10uF  CAPACITOR_0805_N  [RESC0805_N]
C22  1uF  CAPACITOR_0402_N  [RESC0402_N]
C23  0.1uF  CAPACITOR_0402_N  [RESC0402_N]
C24  10uF  CAPACITOR_0805_N  [RESC0805_N]
C25  NFM31PC276B0J3L  [NFM31HK103R1H3L]
C26  10uF  CAPACITOR_0805_N  [RESC0805_N]
C27  0.1uF  CAPACITOR_0402_N  [RESC0402_N]
C28  10uF  CAPACITOR_0805_N  [RESC0805_N]
C29  0.1uF  CAPACITOR_0402_N  [RESC0402_N]
C30  1uF  CAPACITOR_0402_N  [RESC0402_N]
C31  0.1uF  CAPACITOR_0402_N  [RESC0402_N]
C32  1uF  CAPACITOR_0402_N  [RESC0402_N]
C33  0.1uF  CAPACITOR_0402_N  [RESC0402_N]
C35  NFM31PC276B0J3L  [NFM31HK103R1H3L]
C36  10uF  CAPACITOR_0805_N  [RESC0805_N]
C37  0.1uF  CAPACITOR_0402_N  [RESC0402_N]
C38  10uF  CAPACITOR_0805_N  [RESC0805_N]
C39  0.1uF  CAPACITOR_0402_N  [RESC0402_N]
C45  NFM31PC276B0J3L  [NFM31HK103R1H3L]
C46  10uF  CAPACITOR_0805_N  [RESC0805_N]
C47  0.1uF  CAPACITOR_0402_N  [RESC0402_N]
C48  10uF  CAPACITOR_0805_N  [RESC0805_N]
C49  0.1uF  CAPACITOR_0402_N  [RESC0402_N]

### Nets
GND [power]: C5.2(GND_1) C5.4(GND_2) C6.1 C7.1 C8.1 C9.1 C10.1 C11.1 C12.1 C13.1 C14.1 C15.2(GND_1) C15.4(GND_2) C16.1 C17.1 C18.1 C19.1 C20.1 C21.1 C22.1 C23.1 C24.1 C25.2(GND_1) C25.4(GND_2) C26.1 C27.1 C28.1 C29.1 C30.1 C31.1 C32.1 C33.1 C35.2(GND_1) C35.4(GND_2) C36.1 C37.1 C38.1 C39.1 C45.2(GND_1) C45.4(GND_2) C46.1 C47.1 C48.1 C49.1 ; also sheet 1,2
V11_IN [power]: C35.1(IN) C36.2 C37.2 C45.1(IN) C46.2 C47.2 ; also sheet 2
V19_IN [power]: C15.1(IN) C16.2 C17.2 C25.1(IN) C26.2 C27.2 ; also sheet 2
VA11 [power]: C21.2 C22.2 C23.2 C32.2 C33.2 C35.3(OUT) C38.2 C39.2 ; also sheet 2
VA19 [power]: C13.2 C14.2 C20.2 C25.3(OUT) C28.2 C29.2 ; also sheet 2
VD11 [power]: C24.2 C30.2 C31.2 C45.3(OUT) C48.2 C49.2 ; also sheet 2
VDDL19 [power]: C15.3(OUT) C18.2 C19.2 ; also sheet 2
VLVDS [power]: C5.3(OUT) C8.2 C9.2 C10.2 C11.2 C12.2 ; also sheet 2
VLVDS_IN [power]: C5.1(IN) C6.2 C7.2 ; also sheet 2

## Library data of the parts
A14_CLKOUT2- B14_CLKOUT2+ CLK+ CLK- INA+ INA- INB+ INB- R4_CLKOUT+ T4_CLKOUT- = con-coax:BU-SMB-V: FEMALE SMB CONNECTOR Radiall distributor RS 112-2993; OC_FARNELL: unknown; OC_NEWARK: unknown
C1-C4 C6-C14 C16-C24 C26-C33 C36-C39 C46-C49 = Nordic_nRF:CAPACITOR: Generic chip capacitor
C5 C15 C25 C35 C45 = NFM31PC276B0J3L:NFM31PC276B0J3L: Murata NFM31PC Series, EMI Filter, 6.3 V dc, 6A 1206/3216 SMD, Flat Contact Termination, 3.2 x 1.6 x 1.3mm Source: Datasheet <https://psearch.en.murata.com/capacitor/product/NFM31PC276B0J3#.html>; DESCRIPTION: Murata NFM31PC Series, EMI Filter, 6.3 V dc, 6A 1206/3216 SMD, Flat Contact Termination, 3.2 x 1.6 x 1.3mm; HEIGHT: 1.5mm; MANUFACTURER_NAME: Murata Electronics; MANUFACTURER_PART_NUMBER: NFM31PC276B0J3L; MOUSER_PART_NUMBER: 81-NFM31PC276B0J3L; MOUSER_PRICE-STOCK: https://www.mouser.co.uk/ProductDetail/Murata-Electronics/NFM31PC276B0J3L?qs=MY6wChARw2yhbGSppF6%2FUw%3D%3D
IC1 = ADC12DL2500ACF:ADC12DL2500ACF: 12 Bit Analog to Digital Converter 1, 2 Input 2 Folding Interpolating 256-FCBGA (17x17) Source: Datasheet <https://www.ti.com/lit/ds/symlink/adc12dl2500.pdf?ts=1717147635434&ref_url=https%3A%2F%2Fwww.ti.com%2Fproduct%2FADC12DL2500%2Fpart-details%2FADC12DL2500ACF>; DESCRIPTION: 12 Bit Analog to Digital Converter 1, 2 Input 2 Folding Interpolating 256-FCBGA (17x17); HEIGHT: 3.31mm; MANUFACTURER_NAME: Texas Instruments; MANUFACTURER_PART_NUMBER: ADC12DL500ACF
IC2 = SN74AVC4T774PWR:SN74AVC4T774PWR: 4-Bit Dual-Supply Bus Transceiver With Configurable Voltage-Level Shifting and 3-State Outputs Source: Datasheet <http://www.ti.com/lit/gpn/sn74avc4t774>; DESCRIPTION: 4-Bit Dual-Supply Bus Transceiver With Configurable Voltage-Level Shifting and 3-State Outputs; HEIGHT: 1.2mm; MANUFACTURER_NAME: Texas Instruments; MANUFACTURER_PART_NUMBER: SN74AVC4T774PWR; MOUSER_PART_NUMBER: 595-SN74AVC4T774PWR; MOUSER_PRICE-STOCK: https://www.mouser.co.uk/ProductDetail/Texas-Instruments/SN74AVC4T774PWR?qs=WxL8HmPi5r562Eu%2F2kE2LA%3D%3D
J1-J8 J10-J13 J16 J17 = SparkFun-Connectors:CONN_08: Multi connection point. Often used as Generic Header-pin footprint for 0.1 inch spaced/style header connections On any of the 0.1 inch spaced packages, you can populate with these: Break Away Headers - Straight <https://www.sparkfun.com/products/116> (PRT-00116) Break Away Male Headers - Right Angle <https://www.sparkfun.com/products/553> (PRT-00553) Female Headers <https://www.sparkfun.com/products/115> (PRT-00115) Break Away Headers - Machine Pin <https://www.sparkfun.com/products/117> (PRT-00117) Break Away Female Headers - Swiss Machine Pin <https://www.sparkfun.com/products/743> (PRT-00743) Arduino Stackable Header - 8 Pin <https://www.sparkfun.com/products/9279> (PRT-09279) For SCREWTERMINALS and SPRING TERMINALS visit here: Screw Terimnals on SparkFun.com <https://www.sparkfun.com/search/results?term=Screw+Terminals> (5mm/3.5mm/2.54mm spacing) This device is also useful as a general connection point to wire up your design to another part of your project. Our various solder wires solder well into these plated through hole pads. Hook-Up Wire - Assortment (Stranded, 22 AWG) <https://www.sparkfun.com/products/11375> (PRT-11375) Hook-Up Wire - Assortment (Solid Core, 22 AWG) <https://www.sparkfun.com/products/11367> (PRT-11367) View the entire wire category on our website here <https://www.sparkfun.com/categories/141> Special notes: Molex polarized connector foot print use with SKU : PRT-08231 with associated crimp pins and housings. 1MM SMD Version SKU: PRT-10208 NOTES ON THE VARIANTS LOCK and LOCK_LONGPADS... This footprint was designed to help hold the alignment of a through-hole component (i.e. 6-pin header) while soldering it into place. You may notice that each hole has been shifted either up or down by 0.005 of an inch from it's more standard position (which is a perfectly straight line). This slight alteration caused the pins (the squares in the middle) to touch the edges of the holes. Because they are alternating, it causes a "brace" to hold the component in place. 0.005 has proven to be the perfect amount of "off-center" position when using our standard breakaway headers. Although looks a little odd when you look at the bare footprint, once you have a header in there, the alteration is very hard to notice. Also,if you push a header all the way into place, it is covered up entirely on the bottom side.; PROD_ID: CONN-08438
LED1-LED8 LED17-LED48 = adafruit:LED: LED OSRAM: - CHIPLED LG R971, LG N971, LY N971, LG Q971, LY Q971, LO R971, LY R971 LH N974, LH R974 LS Q976, LO Q976, LY Q976 LO Q996 - Hyper CHIPLED LW Q18S LB Q993, LB Q99A, LB R99A - SideLED LS A670, LO A670, LY A670, LG A670, LP A670 LB A673, LV A673, LT A673, LW A673 LH A674 LY A675 LS A676, LA A676, LO A676, LY A676, LW A676 LS A679, LY A679, LG A679 - Hyper Micro SIDELED® LS Y876, LA Y876, LO Y876, LY Y876 LT Y87S - SmartLED LW L88C, LW L88S LB L89C, LB L89S, LG L890 LS L89K, LO L89K, LY L89K LS L896, LA L896, LO L896, LY L896 - TOPLED LS T670, LO T670, LY T670, LG T670, LP T670 LSG T670, LSP T670, LSY T670, LOP T670, LYG T670 LG T671, LOG T671, LSG T671 LB T673, LV T673, LT T673, LW T673 LH T674 LS T676, LA T676, LO T676, LY T676, LB T676, LH T676, LSB T676, LW T676 LB T67C, LV T67C, LT T67C, LS T67K, LO T67K, LY T67K, LW E67C LS E67B, LA E67B, LO E67B, LY E67B, LB E67C, LV E67C, LT E67C LW T67C LS T679, LY T679, LG T679 LS T770, LO T770, LY T770, LG T770, LP T770 LB T773, LV T773, LT T773, LW T773 LH T774 LS E675, LA E675, LY E675, LS T675 LS T776, LA T776, LO T776, LY T776, LB T776 LHGB T686 LT T68C, LB T68C - Hyper Mini TOPLED® LB M676 - Mini TOPLED Santana® LG M470 LS M47K, LO M47K, LY M47K Source: http://www.osram.convergy.de/
PINOUT1 PINOUT2 = Seeed-Connector:DIP-YELLOW-FEMALE-HEADER-VERT(10P-2.54): 320030059
R1-R13 R22-R53 = FlashPCB_Resistors:RES-0402: https://www.digikey.com/en/products/filter/chip-resistor-surface-mount/52?s=N4IgjCBcpgbFoDGUBmBDANgZwKYBoQB7KAbRAGYBOAJgBZ4BdAgBwBcoQBlVgJwEsAdgHMQAX1EFqpEDxxY%2BWVoR4gGooA
X1 X2 X15 X16 = con-molex:87758-1616: 16 Pin - 2mm Dual Row Single Wafer, Vertical T/H HDR Source: http://www.molex.com/pdm_docs/sd/877580616_sd.pdf; MF: MOLEX; MPN: 87758-1616; OC_FARNELL: 7472366; OC_NEWARK: 59J1563
X13 X14 X17 X18 = con-molex:87758-2816: 28 Pin - 2mm Dual Row Single Wafer, Vertical T/H HDR Source: http://www.molex.com/pdm_docs/sd/877580616_sd.pdf; MF: MOLEX; MPN: 87758-2816; OC_FARNELL: unknown; OC_NEWARK: 25M5681

## Net classes
0 default: width 0.089 mm
1 power: width 0.152 mm
2 diffpair: width 0.089 mm
3 loosediffpair: width 0.152 mm, clearance 0.305 mm to class 0, clearance 0.305 mm to class 1, clearance 0.305 mm to class 2, clearance 0.305 mm